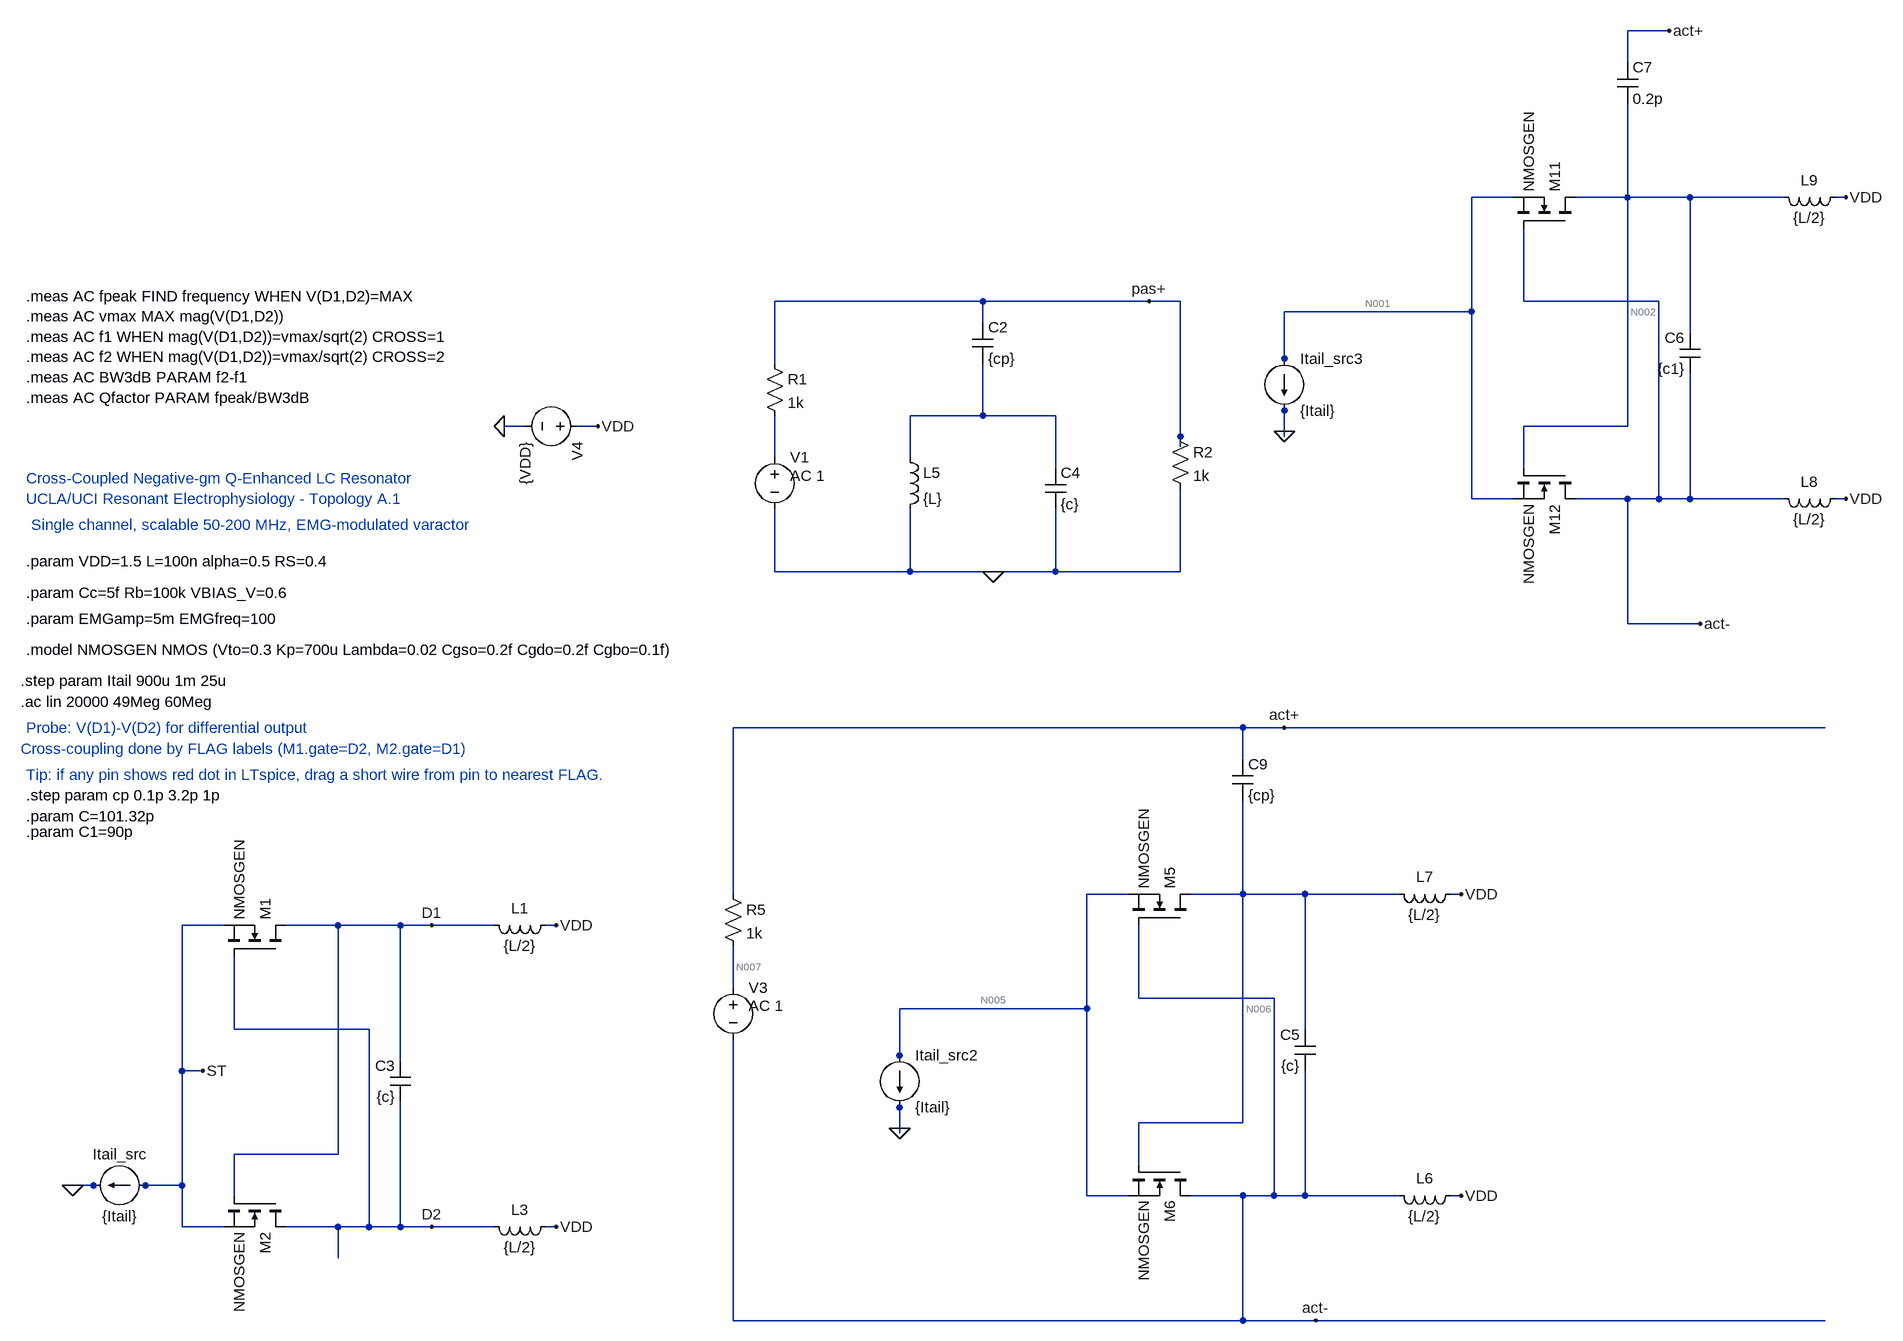
[diagram p0: schematic CROSS COUPLED_combined.asc]
CROSS COUPLED_combined.asc, the LTspice schematic file:
Version 4.1
SHEET 1 5816 1304
WIRE 1424 -1888 1360 -1888
WIRE 1360 -1840 1360 -1888
WIRE 1184 -1632 1120 -1632
WIRE 1360 -1632 1360 -1776
WIRE 1360 -1632 1280 -1632
WIRE 1456 -1632 1360 -1632
WIRE 1600 -1632 1456 -1632
WIRE 1696 -1632 1680 -1632
WIRE 368 -1472 48 -1472
WIRE 624 -1472 368 -1472
WIRE 672 -1472 624 -1472
WIRE 1200 -1472 1200 -1584
WIRE 1408 -1472 1200 -1472
WIRE 1120 -1456 1120 -1632
WIRE 1120 -1456 832 -1456
WIRE 368 -1440 368 -1472
WIRE 1456 -1424 1456 -1632
WIRE 832 -1384 832 -1456
WIRE 48 -1376 48 -1472
WIRE 832 -1376 832 -1384
WIRE 832 -1304 832 -1312
WIRE 368 -1296 368 -1376
WIRE 368 -1296 256 -1296
WIRE 480 -1296 368 -1296
WIRE -336 -1280 -368 -1280
WIRE -224 -1280 -256 -1280
WIRE 1360 -1280 1360 -1632
WIRE 1360 -1280 1200 -1280
WIRE 832 -1272 832 -1304
WIRE 672 -1264 672 -1472
WIRE 832 -1264 832 -1272
WIRE 672 -1248 672 -1264
WIRE 48 -1232 48 -1296
WIRE 256 -1232 256 -1296
WIRE 480 -1216 480 -1296
WIRE 1200 -1216 1200 -1280
WIRE 1120 -1168 1120 -1456
WIRE 1184 -1168 1120 -1168
WIRE 1360 -1168 1280 -1168
WIRE 1408 -1168 1408 -1472
WIRE 1408 -1168 1360 -1168
WIRE 1456 -1168 1456 -1360
WIRE 1456 -1168 1408 -1168
WIRE 1600 -1168 1456 -1168
WIRE 1696 -1168 1680 -1168
WIRE 48 -1056 48 -1152
WIRE 256 -1056 256 -1152
WIRE 256 -1056 48 -1056
WIRE 384 -1056 256 -1056
WIRE 480 -1056 480 -1152
WIRE 480 -1056 384 -1056
WIRE 672 -1056 672 -1184
WIRE 672 -1056 480 -1056
WIRE 1360 -976 1360 -1168
WIRE 1472 -976 1360 -976
WIRE 768 -816 -16 -816
WIRE 832 -816 768 -816
WIRE 1664 -816 832 -816
WIRE 768 -768 768 -816
WIRE -16 -560 -16 -816
WIRE 592 -560 528 -560
WIRE 768 -560 768 -704
WIRE 768 -560 688 -560
WIRE 864 -560 768 -560
WIRE 1008 -560 864 -560
WIRE 1104 -560 1088 -560
WIRE -800 -512 -864 -512
WIRE -624 -512 -704 -512
WIRE -528 -512 -624 -512
WIRE -480 -512 -528 -512
WIRE -384 -512 -480 -512
WIRE -288 -512 -304 -512
WIRE -16 -416 -16 -480
WIRE 608 -400 608 -512
WIRE 816 -400 608 -400
WIRE 528 -384 528 -560
WIRE 528 -384 240 -384
WIRE -784 -352 -784 -464
WIRE -576 -352 -784 -352
WIRE 864 -352 864 -560
WIRE 240 -312 240 -384
WIRE -528 -304 -528 -512
WIRE 240 -304 240 -312
WIRE -864 -288 -864 -512
WIRE -832 -288 -864 -288
WIRE 240 -232 240 -240
WIRE 768 -208 768 -560
WIRE 768 -208 608 -208
WIRE 240 -200 240 -232
WIRE 240 -192 240 -200
WIRE -624 -160 -624 -512
WIRE -624 -160 -784 -160
WIRE 608 -144 608 -208
WIRE -1032 -112 -1040 -112
WIRE -1000 -112 -1032 -112
WIRE -992 -112 -1000 -112
WIRE -920 -112 -928 -112
WIRE -864 -112 -864 -288
WIRE -864 -112 -920 -112
WIRE -784 -96 -784 -160
WIRE 528 -96 528 -384
WIRE 592 -96 528 -96
WIRE 768 -96 688 -96
WIRE 816 -96 816 -400
WIRE 816 -96 768 -96
WIRE 864 -96 864 -288
WIRE 864 -96 816 -96
WIRE 1008 -96 864 -96
WIRE 1104 -96 1088 -96
WIRE -864 -48 -864 -112
WIRE -800 -48 -864 -48
WIRE -624 -48 -704 -48
WIRE -576 -48 -576 -352
WIRE -576 -48 -624 -48
WIRE -528 -48 -528 -240
WIRE -528 -48 -576 -48
WIRE -480 -48 -528 -48
WIRE -384 -48 -480 -48
WIRE -288 -48 -304 -48
WIRE -624 0 -624 -48
WIRE -16 96 -16 -336
WIRE 768 96 768 -96
WIRE 768 96 -16 96
WIRE 880 96 768 96
WIRE 1664 96 880 96
FLAG -1032 -112 0
FLAG -288 -48 VDD
FLAG -288 -512 VDD
FLAG -480 -48 D2
FLAG -480 -512 D1
FLAG -832 -288 ST
FLAG -224 -1280 VDD
FLAG -368 -1280 0
FLAG 1104 -96 VDD
FLAG 1104 -560 VDD
FLAG 240 -200 0
FLAG 832 -816 act+
FLAG 880 96 act-
FLAG 624 -1472 pas+
FLAG 384 -1056 0
FLAG 1696 -1168 VDD
FLAG 1696 -1632 VDD
FLAG 832 -1272 0
FLAG 1424 -1888 act+
FLAG 1472 -976 act-
SYMBOL current -920 -112 R90
WINDOW 0 -32 40 VBottom 2
WINDOW 3 32 40 VTop 2
SYMATTR InstName Itail_src
SYMATTR Value {Itail}
SYMBOL nmos -704 -464 M270
SYMATTR InstName M1
SYMATTR Value NMOSGEN
SYMBOL nmos -704 -96 R90
SYMATTR InstName M2
SYMATTR Value NMOSGEN
SYMBOL ind -288 -64 R90
WINDOW 0 5 56 VBottom 2
WINDOW 3 32 56 VTop 2
SYMATTR InstName L3
SYMATTR Value {L/2}
SYMATTR SpiceLine Rser={RS/2}
SYMBOL ind -288 -528 R90
WINDOW 0 5 56 VBottom 2
WINDOW 3 32 56 VTop 2
SYMATTR InstName L1
SYMATTR Value {L/2}
SYMATTR SpiceLine Rser={RS/2}
SYMBOL cap -512 -240 R180
WINDOW 0 24 56 Left 2
WINDOW 3 24 8 Left 2
SYMATTR InstName C3
SYMATTR Value {c}
SYMBOL voltage -240 -1280 R90
WINDOW 123 0 0 Left 0
WINDOW 39 0 0 Left 0
SYMATTR InstName V4
SYMATTR Value {VDD}
SYMBOL voltage 48 -1248 R0
WINDOW 123 24 44 Left 2
WINDOW 39 0 0 Left 0
SYMATTR Value2 AC 1
SYMATTR InstName V1
SYMATTR Value ""
SYMBOL res 32 -1392 R0
SYMATTR InstName R1
SYMATTR Value 1k
SYMBOL cap 352 -1440 R0
SYMATTR InstName C2
SYMATTR Value {cp}
SYMBOL cap 464 -1216 R0
SYMATTR InstName C4
SYMATTR Value {c}
SYMBOL ind 240 -1248 R0
SYMATTR InstName L5
SYMATTR Value {L}
SYMATTR SpiceLine Rser=1
SYMBOL res 656 -1280 R0
SYMATTR InstName R2
SYMATTR Value 1k
SYMBOL nmos 688 -512 M270
SYMATTR InstName M5
SYMATTR Value NMOSGEN
SYMBOL nmos 688 -144 R90
SYMATTR InstName M6
SYMATTR Value NMOSGEN
SYMBOL ind 1104 -112 R90
WINDOW 0 5 56 VBottom 2
WINDOW 3 32 56 VTop 2
SYMATTR InstName L6
SYMATTR Value {L/2}
SYMATTR SpiceLine Rser={RS/2}
SYMBOL ind 1104 -576 R90
WINDOW 0 5 56 VBottom 2
WINDOW 3 32 56 VTop 2
SYMATTR InstName L7
SYMATTR Value {L/2}
SYMATTR SpiceLine Rser={RS/2}
SYMBOL cap 880 -288 R180
WINDOW 0 24 56 Left 2
WINDOW 3 24 8 Left 2
SYMATTR InstName C5
SYMATTR Value {c}
SYMBOL voltage -16 -432 R0
WINDOW 123 24 44 Left 2
WINDOW 39 0 0 Left 0
SYMATTR Value2 AC 1
SYMATTR InstName V3
SYMATTR Value ""
SYMBOL res -32 -576 R0
SYMATTR InstName R5
SYMATTR Value 1k
SYMBOL cap 752 -768 R0
SYMATTR InstName C9
SYMATTR Value {cp}
SYMBOL current 240 -312 R0
SYMATTR InstName Itail_src2
SYMATTR Value {Itail}
SYMBOL nmos 1280 -1584 M270
SYMATTR InstName M11
SYMATTR Value NMOSGEN
SYMBOL nmos 1280 -1216 R90
SYMATTR InstName M12
SYMATTR Value NMOSGEN
SYMBOL ind 1696 -1184 R90
WINDOW 0 5 56 VBottom 2
WINDOW 3 32 56 VTop 2
SYMATTR InstName L8
SYMATTR Value {L/2}
SYMATTR SpiceLine Rser={RS/2}
SYMBOL ind 1696 -1648 R90
WINDOW 0 5 56 VBottom 2
WINDOW 3 32 56 VTop 2
SYMATTR InstName L9
SYMATTR Value {L/2}
SYMATTR SpiceLine Rser={RS/2}
SYMBOL cap 1472 -1360 R180
WINDOW 0 24 56 Left 2
WINDOW 3 24 8 Left 2
SYMATTR InstName C6
SYMATTR Value {c1}
SYMBOL cap 1344 -1840 R0
SYMATTR InstName C7
SYMATTR Value 0.2p
SYMBOL current 832 -1384 R0
SYMATTR InstName Itail_src3
SYMATTR Value {Itail}
TEXT -1104 -1200 Left 2 ;Cross-Coupled Negative-gm Q-Enhanced LC Resonator
TEXT -1104 -1168 Left 2 ;UCLA/UCI Resonant Electrophysiology - Topology A.1
TEXT -1096 -1128 Left 2 ;Single channel, scalable 50-200 MHz, EMG-modulated varactor
TEXT -1104 -1072 Left 2 !.param VDD=1.5 L=100n alpha=0.5 RS=0.4
TEXT -1104 -1024 Left 2 !.param Cc=5f Rb=100k VBIAS_V=0.6
TEXT -1104 -984 Left 2 !.param EMGamp=5m EMGfreq=100
TEXT -1104 -936 Left 2 !.model NMOSGEN NMOS (Vto=0.3 Kp=700u Lambda=0.02 Cgso=0.2f Cgdo=0.2f Cgbo=0.1f)
TEXT -1112 -888 Left 2 !.step param Itail 900u 1m 25u
TEXT -1104 -816 Left 2 ;Probe: V(D1)-V(D2) for differential output
TEXT -1112 -784 Left 2 ;Cross-coupling done by FLAG labels (M1.gate=D2, M2.gate=D1)
TEXT -1104 -744 Left 2 ;Tip: if any pin shows red dot in LTspice, drag a short wire from pin to nearest FLAG.
TEXT -1112 -856 Left 2 !.ac lin 20000 49Meg 60Meg
TEXT -1104 -712 Left 2 !.step param cp 0.1p 3.2p 1p
TEXT -1104 -1480 Left 2 !.meas AC fpeak FIND frequency WHEN V(D1,D2)=MAX\n.meas AC vmax MAX mag(V(D1,D2))\n.meas AC f1 WHEN mag(V(D1,D2))=vmax/sqrt(2) CROSS=1\n.meas AC f2 WHEN mag(V(D1,D2))=vmax/sqrt(2) CROSS=2\n.meas AC BW3dB PARAM f2-f1\n.meas AC Qfactor PARAM fpeak/BW3dB
TEXT -1104 -680 Left 2 !.param C=101.32p
TEXT -1104 -656 Left 2 !.param C1=90p

The netlist it stands for:
* CROSS COUPLED_combined.asc
Itail_src ST 0 {Itail}
M1 D1 D2 ST ST NMOSGEN
M2 D2 D1 ST ST NMOSGEN
L3 VDD D2 {L/2} Rser={RS/2}
L1 VDD D1 {L/2} Rser={RS/2}
C3 D2 D1 {c}
V4 VDD 0 {VDD}
V1 N004 0 AC 1
R1 pas+ N004 1k
C2 pas+ N003 {cp}
C4 N003 0 {c}
L5 N003 0 {L} Rser=1
R2 pas+ 0 1k
M5 N006 act- N005 N005 NMOSGEN
M6 act- N006 N005 N005 NMOSGEN
L6 VDD act- {L/2} Rser={RS/2}
L7 VDD N006 {L/2} Rser={RS/2}
C5 act- N006 {c}
V3 N007 act- AC 1
R5 act+ N007 1k
C9 act+ N006 {cp}
Itail_src2 N005 0 {Itail}
M11 N002 act- N001 N001 NMOSGEN
M12 act- N002 N001 N001 NMOSGEN
L8 VDD act- {L/2} Rser={RS/2}
L9 VDD N002 {L/2} Rser={RS/2}
C6 act- N002 {c1}
C7 act+ N002 0.2p
Itail_src3 N001 0 {Itail}
.model NMOS NMOS
.model PMOS PMOS
.lib standard.mos
* Cross-Coupled Negative-gm Q-Enhanced LC Resonator
* UCLA/UCI Resonant Electrophysiology - Topology A.1
* Single channel, scalable 50-200 MHz, EMG-modulated varactor
.param VDD=1.5 L=100n alpha=0.5 RS=0.4
.param Cc=5f Rb=100k VBIAS_V=0.6
.param EMGamp=5m EMGfreq=100
.model NMOSGEN NMOS (Vto=0.3 Kp=700u Lambda=0.02 Cgso=0.2f Cgdo=0.2f Cgbo=0.1f)
.step param Itail 900u 1m 25u
* Probe: V(D1)-V(D2) for differential output
* Cross-coupling done by FLAG labels (M1.gate=D2, M2.gate=D1)
* Tip: if any pin shows red dot in LTspice, drag a short wire from pin to nearest FLAG.
.ac lin 20000 49Meg 60Meg
.step param cp 0.1p 3.2p 1p
.meas AC fpeak FIND frequency WHEN V(D1,D2)=MAX
.meas AC vmax MAX mag(V(D1,D2))
.meas AC f1 WHEN mag(V(D1,D2))=vmax/sqrt(2) CROSS=1
.meas AC f2 WHEN mag(V(D1,D2))=vmax/sqrt(2) CROSS=2
.meas AC BW3dB PARAM f2-f1
.meas AC Qfactor PARAM fpeak/BW3dB
.param C=101.32p
.param C1=90p
.backanno
.end

* Results of the author's LTspice run, read from the files saved beside the schematic
* Operating Point (first step), zero values left out:
*   V(act+) = 1.5 V
*   V(act-) = 1.5 V
*   V(d1) = 1.5 V
*   V(d2) = 1.5 V
*   V(n001) = 81.76 mV
*   V(n002) = 1.5 V
*   V(n005) = 81.76 mV
*   V(n006) = 1.5 V
*   V(n007) = 1.5 V
*   V(st) = 81.76 mV
*   V(vdd) = 1.5 V
*   I(Itail_src) = 900 µA
*   I(Itail_src2) = 900 µA
*   I(Itail_src3) = 900 µA
*   I(L1) = 450 µA
*   I(L3) = 450 µA
*   I(L6) = 450 µA
*   I(L7) = 450 µA
*   I(L8) = 450 µA
*   I(L9) = 450 µA
*   I(V4) = -2.7 mA
*   Ib(M1) = -1.428 pA
*   Ib(M11) = -1.428 pA
*   Ib(M12) = -1.428 pA
*   Ib(M2) = -1.428 pA
*   Ib(M5) = -1.428 pA
*   Ib(M6) = -1.428 pA
*   Id(M1) = 450 µA
*   Id(M11) = 450 µA
*   Id(M12) = 450 µA
*   Id(M2) = 450 µA
*   Id(M5) = 450 µA
*   Id(M6) = 450 µA
*   Is(M1) = -450 µA
*   Is(M11) = -450 µA
*   Is(M12) = -450 µA
*   Is(M2) = -450 µA
*   Is(M5) = -450 µA
*   Is(M6) = -450 µA